# Altium schematic sheet IO.SchDoc: IO
size A
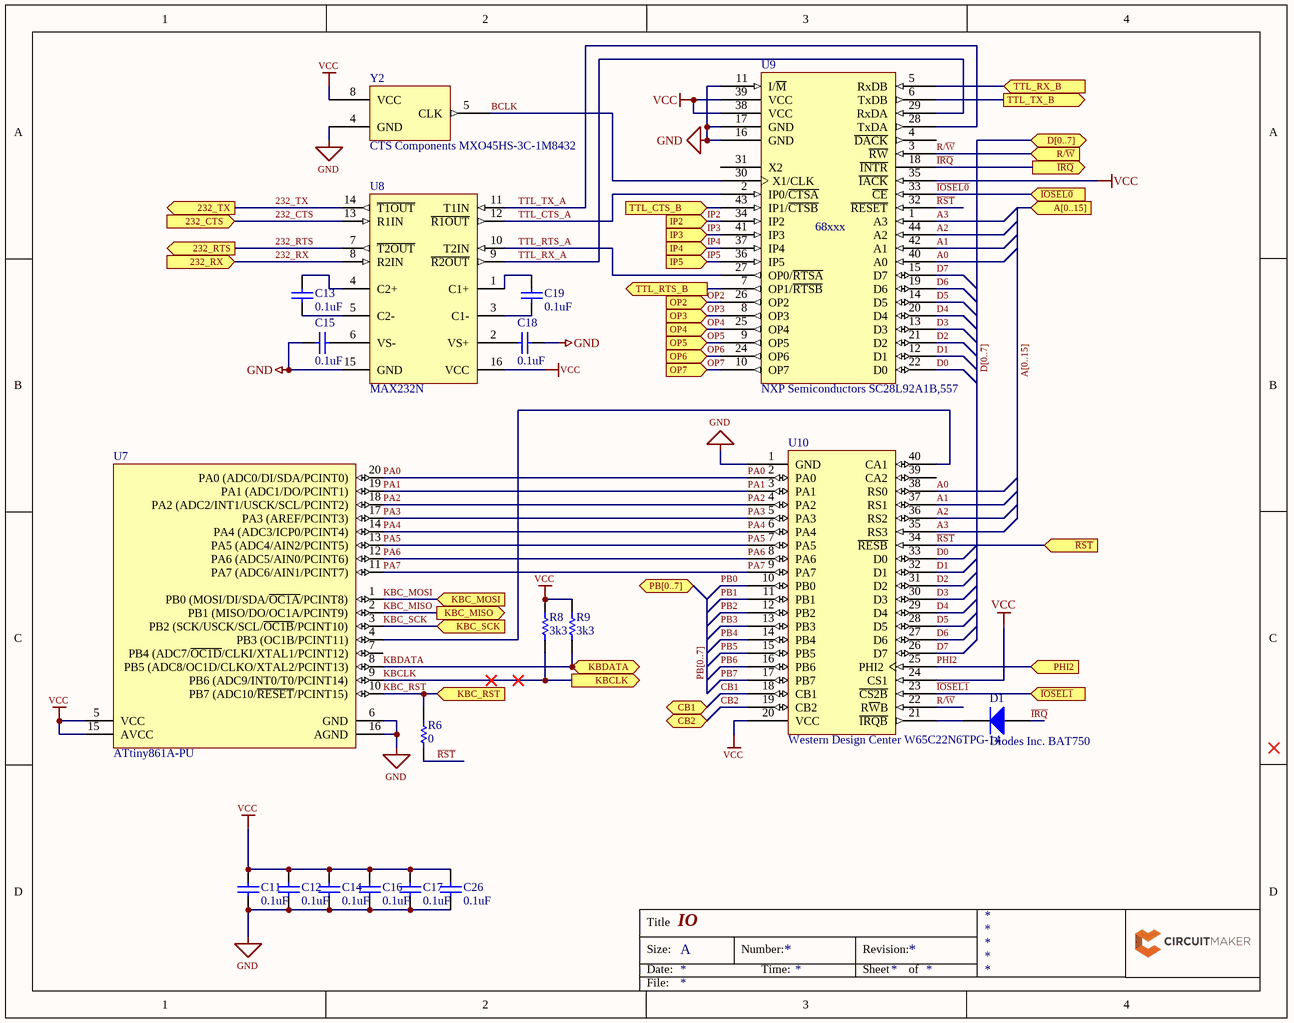
[diagram p0: IO.SchDoc]

## Parts
C11  0.1uF  [CAPC1608X90X35NL15T15]
C12  0.1uF  [CAPC1608X90X35NL15T15]
C13  0.1uF  [CAPC1608X90X35NL15T15]
C14  0.1uF  [CAPC1608X90X35NL15T15]
C15  0.1uF  [CAPC1608X90X35NL15T15]
C16  0.1uF  [CAPC1608X90X35NL15T15]
C17  0.1uF  [CAPC1608X90X35NL15T15]
C18  0.1uF  [CAPC1608X90X35NL15T15]
C19  0.1uF  [CAPC1608X90X35NL15T15]
C26  0.1uF  [CAPC1608X90X35NL15T15]
D1  Diodes Inc. BAT750  [PCB-424japtr4l4h57iluqnj-1]
R6  0  [RESC1608X55X30ML20T10]
R8  3k3  [RESC1608X55X30ML20T10]
R9  3k3  [RESC1608X55X30ML20T10]
U7  ATtiny861A-PU  [20P3]
U8  MAX232N  [TI-N16]
U9  NXP Semiconductors SC28L92A1B,557  [PCB-gqi0ukwbi8o3vwizgqut-1]
U10  Western Design Center W65C22N6TPG-14  [PCB-fzv7zhlkwo7pvhyncebf-1]
Y2  CTS Components MXO45HS-3C-1M8432  [PCB-9wf0uyermkn85h0e2qa4-1]

## Ports
232_CTS (in), 232_RTS (out), 232_RX (in), 232_TX (out), A[0..15] (in), CB1, CB2, D[0..7] (bidir), IP2 (in), IP3 (in), IP4 (in), IP5 (in), KBC_MISO (out), KBC_MOSI (in), KBC_RST (in), KBC_SCK (in), KBCLK (out), KBDATA, OP2 (in), OP3 (in), OP4 (in), OP5 (in), OP6 (in), OP7 (in), PB[0..7] (bidir), PHI2 (in), R/~{W} (in), TTL_CTS_B (in), TTL_RTS_B (out), TTL_RX_B (in), TTL_TX_B (out), ~{IOSEL0} (in), ~{IOSEL1} (in), ~{IRQ} (out), ~{RST} (in)

## Nets
GND: C11.1 C12.1 C14.1 C15.1 C16.1 C17.1 C18.2 C26.1 U7.6(GND) U7.16(AGND) U8.15(GND) U9.11(I/~{M}) U9.16(GND) U9.17(GND) U10.1(GND) Y2.4(GND)
VCC: C11.2 C12.2 C14.2 C16.2 C17.2 C26.2 R8.2 R9.2 U7.5(VCC) U7.15(AVCC) U8.16(VCC) U9.35(~{IACK}) U9.38(VCC) U9.39(VCC) U10.20(VCC) U10.24(CS1) Y2.8(VCC)
232_CTS: U8.13(R1IN) ; port 232_CTS
232_RTS: U8.7(~{T2OUT}) ; port 232_RTS
232_RX: U8.8(R2IN) ; port 232_RX
232_TX: U8.14(~{T1OUT}) ; port 232_TX
A0: U9.40(A0) U10.38(RS0)
A1: U9.42(A1) U10.37(RS1)
A2: U9.44(A2) U10.36(RS2)
A3: U9.1(A3) U10.35(RS3)
BCLK: U9.30(X1/CLK) Y2.5(CLK)
CB1: U10.18(CB1) ; port CB1
CB2: U10.19(CB2) ; port CB2
D0: U9.22(D0) U10.33(D0)
D1: U9.12(D1) U10.32(D1)
D2: U9.21(D2) U10.31(D2)
D3: U9.13(D3) U10.30(D3)
D4: U9.20(D4) U10.29(D4)
D5: U9.14(D5) U10.28(D5)
D6: U9.19(D6) U10.27(D6)
D7: U9.15(D7) U10.26(D7)
~{IOSEL0}: U9.33(~{CE}) ; port ~{IOSEL0}
~{IOSEL1}: U10.23(~{CS2B}) ; port ~{IOSEL1}
~{IRQ}: D1.1(A) U9.18(~{INTR}) ; port ~{IRQ}
IP2: U9.34(IP2) ; port IP2
IP3: U9.41(IP3) ; port IP3
IP4: U9.37(IP4) ; port IP4
IP5: U9.36(IP5) ; port IP5
KBC_MISO: U7.2(PB1_(MISO/DO/OC1A/PCINT9)) ; port KBC_MISO
KBC_MOSI: U7.1(PB0_(MOSI/DI/SDA/~{OC1A}/PCINT8)) ; port KBC_MOSI
KBC_RST: R6.1 U7.10(PB7_(ADC10/~{RESET}/PCINT15)) ; port KBC_RST
KBC_SCK: U7.3(PB2_(SCK/USCK/SCL/~{OC1B}/PCINT10)) ; port KBC_SCK
KBCLK: R8.1 U7.9(PB6_(ADC9/INT0/T0/PCINT14)) ; port KBCLK
KBDATA: R9.1 U7.8(PB5_(ADC8/OC1D/CLKO/XTAL2/PCINT13)) ; port KBDATA
OP2: U9.26(OP2) ; port OP2
OP3: U9.8(OP3) ; port OP3
OP4: U9.25(OP4) ; port OP4
OP5: U9.9(OP5) ; port OP5
OP6: U9.24(OP6) ; port OP6
OP7: U9.10(OP7) ; port OP7
PA0: U7.20(PA0_(ADC0/DI/SDA/PCINT0)) U10.2(PA0)
PA1: U7.19(PA1_(ADC1/DO/PCINT1)) U10.3(PA1)
PA2: U7.18(PA2_(ADC2/INT1/USCK/SCL/PCINT2)) U10.4(PA2)
PA3: U7.17(PA3_(AREF/PCINT3)) U10.5(PA3)
PA4: U7.14(PA4_(ADC3/ICP0/PCINT4)) U10.6(PA4)
PA5: U7.13(PA5_(ADC4/AIN2/PCINT5)) U10.7(PA5)
PA6: U7.12(PA6_(ADC5/AIN0/PCINT6)) U10.8(PA6)
PA7: U7.11(PA7_(ADC6/AIN1/PCINT7)) U10.9(PA7)
PB0: U10.10(PB0)
PB1: U10.11(PB1)
PB2: U10.12(PB2)
PB3: U10.13(PB3)
PB4: U10.14(PB4)
PB5: U10.15(PB5)
PB6: U10.16(PB6)
PB7: U10.17(PB7)
PHI2: U10.25(PHI2) ; port PHI2
R/~{W}: U9.3(~{RW}) U10.22(R~{W}B) ; port R/~{W}
~{RST}: R6.2 U9.32(~{RESET}) U10.34(~{RESB}) ; port ~{RST}
TTL_CTS_A: U8.12(~{R1OUT}) U9.2(IP0/~{CTSA})
TTL_CTS_B: U9.43(IP1/~{CTSB}) ; port TTL_CTS_B
TTL_RTS_A: U8.10(T2IN) U9.27(OP0/~{RTSA})
TTL_RTS_B: U9.7(OP1/~{RTSB}) ; port TTL_RTS_B
TTL_RX_A: U8.9(~{R2OUT}) U9.29(RxDA)
TTL_RX_B: U9.5(RxDB) ; port TTL_RX_B
TTL_TX_A: U8.11(T1IN) U9.28(TxDA)
TTL_TX_B: U9.6(TxDB) ; port TTL_TX_B
NetC13_1: C13.1 U8.5(C2-)
NetC13_2: C13.2 U8.4(C2+)
NetC15_2: C15.2 U8.6(VS-)
NetC18_1: C18.1 U8.2(VS+)
NetC19_1: C19.1 U8.3(C1-)
NetC19_2: C19.2 U8.1(C1+)
NetD1_3: D1.3(K) U10.21(~{IRQB})
NetU7_4: U7.4(PB3_(OC1B/PCINT11)) U10.40(CA1)

Not connected (* = marked no-connect by the designer): U7 7(PB4_(ADC7/~{OC1D}/CLKI/XTAL1/PCINT12)); U9 4(~{DACK}) 23(NC) 31(X2); U10 39(CA2)

## Buses and harness runs
bus A[0..15] = port A[0..15]
bus D[0..7] = port D[0..7]
bus PB[0..7] = port PB[0..7]

## Notes on the sheet
- Title
- Size:
- Date:
- A
- Number:
- Time:
- Revision:
- Sheet
- of
- File:
- (in symbol CMP-1b55d2ce0277c492-1) 68xxx

## Library data of the parts
C11-C19 C26 = CMP-15328962-11: 0603 0.1uF Capacitor; Insulation Resistance: 1e+11 Ω; Voltage Rating (DC): 16.0 V; Lead-Free Status: Lead Free; Dielectric Material: Ceramic Multilayer; Dielectric Characteristic: X7R; Capacitance Tolerance: ±10%; Capacitance: 1e-07 F; OctopartID: 0cd5c6920958d312; Number of Pins: 2; Size-Length: 0.0016002 m; Octopart Url: https://octopart.com/0603yc104kat2a-avx+interconnect+%2F+elco-55386347; Size-Height: 0.00086 m; Case/Package: 0603; REACH SVHC Compliance: No SVHC; RoHS: Compliant; Mounting Style: Surface Mount; Size-Width: 0.0008128 m
D1 = Diodes Inc. BAT750-1: VR = 40V  IF = 750mA  VF < 490mV @ 750mA SOT23; Octopart URL: http://octopart.com/bat750-diodes+inc.-14755917; Manufacturer Part Number: BAT750; Case/Package: SOT-23; RoHS: Compliant; Lifecycle Status: Active; OctopartID: bfb87653b293607f
R6 R8 R9 = CMP-3658446-2: Thick Film Resistors - SMD 1/10watt 3.3Kohms 1%; Lead-Free Status: Lead Free; Power Rating: 0.1 W; Resistance: 3300.0 Ω; Case/Package: 0603; Mounting Style: Surface Mount; Octopart Url: https://octopart.com/rk73h1jttd3301f-koa+speer-5071100; OctopartID: 55949cd3100e8a53; Resistance Tolerance: ±1%; RoHS: Compliant
U7 = CMP-2386869-3: 8-bit AVR Microcontroller, 2.7-5.5V, 20MHz, 8KB Flash, 512 Bytes EEPROM, 512 Bytes SRAM, 20-pin PDIP, Industrial Grade (-40°C to 85°C); Supply Voltage (DC): 5.0 V; Number of Bits: 8; FLASH Memory Size: 8192 B; RAM Memory Size: 512 B; Clock Speed: 20000000.0 Hz; Number of I/O Pins: 16; Access Time: 2e-05 s; Lead-Free Status: Lead Free; Mounting Style: Through Hole; Core Architecture: AVR; Octopart Url: https://octopart.com/attiny861-20pu-atmel-39622145; RoHS: Compliant; Number of Pins: 20; OctopartID: 25b2eee496d5fa75; REACH SVHC Compliance: No SVHC; Packaging: Tube; Case/Package: DIP
U8 = CMP-14952750-3: Dual EIA-232 Driver / Receiver, 0 to 70 degC, 16-Pin PDIP (N), Pb-Free (RoHS); Drivers Per Package: 2; Supply Current: 0.008 A; Lead-Free Status: Lead Free; Data Rate: 120000.0 bps; OctopartID: a8826188882e7745; REACH SVHC Compliance: No SVHC; Octopart Url: https://octopart.com/max232n-texas+instruments-1482; Lifecycle Status: Active; Number of Pins: 16; Mounting Style: Through Hole; Packaging: Tube; RoHS: Compliant
U9 = CMP-1b55d2ce0277c492-1: Integrated circuits from leading manufacturers. Please read our extensive documentation which is free to download.; Supply Voltage (DC): 2.97 V (min); Data Rate: 230 kbps; Lead-Free Status: Lead Free; Octopart URL: http://octopart.com/sc28l92a1b%2C557-nxp+semiconductors-9518148; Manufacturer Part Number: SC28L92A1B,557; RoHS: Compliant; REACH SVHC Compliance: No SVHC; Mounting Style: Surface Mount; Packaging: Tray; Case/Package: QFP; Lifecycle Status: Active; Number of Pins: 44; OctopartID: 1b55d2ce0277c492
U10 = CMP-efc5278ec54e3002-3: W65C22N Versatile Interface Adapter (VIA); OctopartID: efc5278ec54e3002; Octopart URL: http://octopart.com/w65c22n6tpg-14-western+design+center-21041133; Manufacturer Part Number: W65C22N6TPG-14; Mounting Style: Through Hole; Packaging: Tube; RoHS: Compliant; Case/Package: PDIP
Y2 = CMP-6487ad4d37bebb40-3: Oscillator XO 1.8432MHz ±50ppm 50pF (Stability) HCMOS/TTL 55% 5V 4-Pin Metal DIP Thru-Hole Tray; Manufacturer Part Number: MXO45HS-3C-1M8432; Mounting Style: Through Hole; RoHS: Compliant; OctopartID: 6487ad4d37bebb40; Octopart URL: http://octopart.com/mxo45hs-3c-1m8432-cts+components-12613215